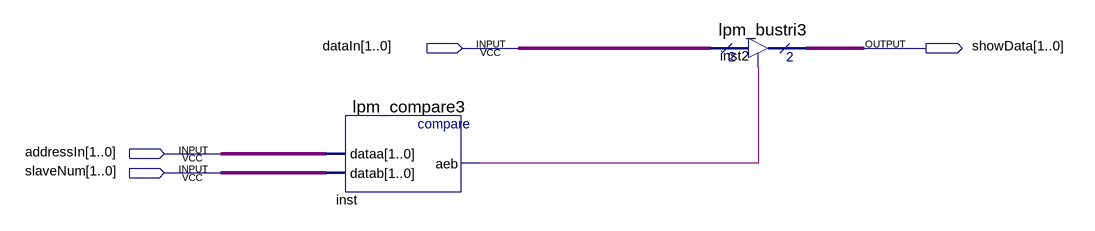
[diagram p0: schematic sheet]
// Quartus schematic Slave.bdf as structural Verilog: 2 symbols, 4 pins
module Slave (
  input  [1:0] dataIn,
  input  [1:0] addressIn,
  input  [1:0] slaveNum,
  output [1:0] showData
);

  wire inst_aeb;

  lpm_compare3 inst (.dataa(addressIn), .datab(slaveNum), .aeb(inst_aeb));
  lpm_bustri3 inst2 (.enabledt(inst_aeb), .data(dataIn), .tridata(showData));
endmodule
